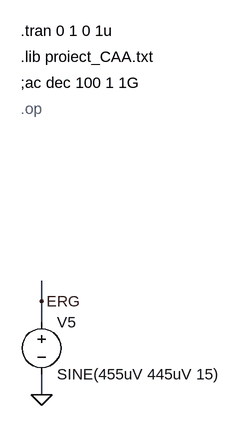
[diagram p0: schematic test_ERG_signal.asc]
test_ERG_signal.asc, the LTspice schematic file:
Version 4
SHEET 1 1600 1516
WIRE 96 528 96 496
WIRE 96 560 96 528
WIRE 96 672 96 640
FLAG 96 672 0
FLAG 96 528 ERG
SYMBOL voltage 96 544 R0
WINDOW 123 0 0 Left 2
WINDOW 39 0 0 Left 2
SYMATTR InstName V5
SYMATTR Value SINE(455uV 445uV 15)
TEXT 64 152 Left 2 !.lib proiect_CAA.txt
TEXT 64 192 Left 2 !;ac dec 100 1 1G
TEXT 64 232 Left 2 ;.op
TEXT 64 112 Left 2 !.tran 0 1 0 1u

The netlist it stands for:
* test_ERG_signal.asc
V5 ERG 0 SINE(455uV 445uV 15)
.lib proiect_CAA.txt
;ac dec 100 1 1G
* .op
.tran 0 1 0 1u
.backanno
.end

* Results of the author's LTspice run, read from the files saved beside the schematic
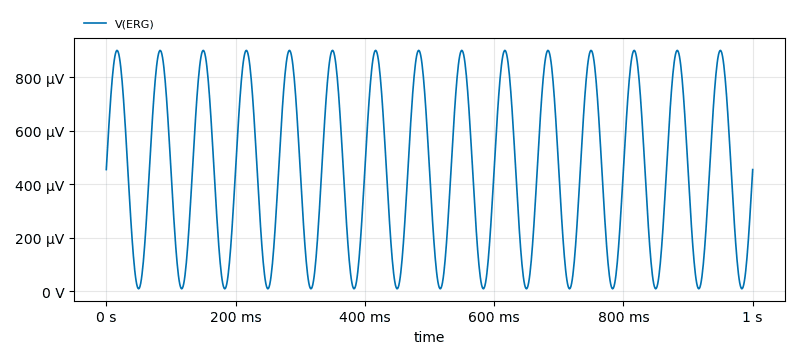
[diagram p1: Transient Analysis of test_ERG_signal.asc, plotted from the saved traces]
* Transient Analysis, 1 run:
*   V(ERG): min 10 µV, max 900 µV, average 455 µV, rms 553.2 µV, last 455 µV